# Altium project F800 Rear wire.PrjPcb
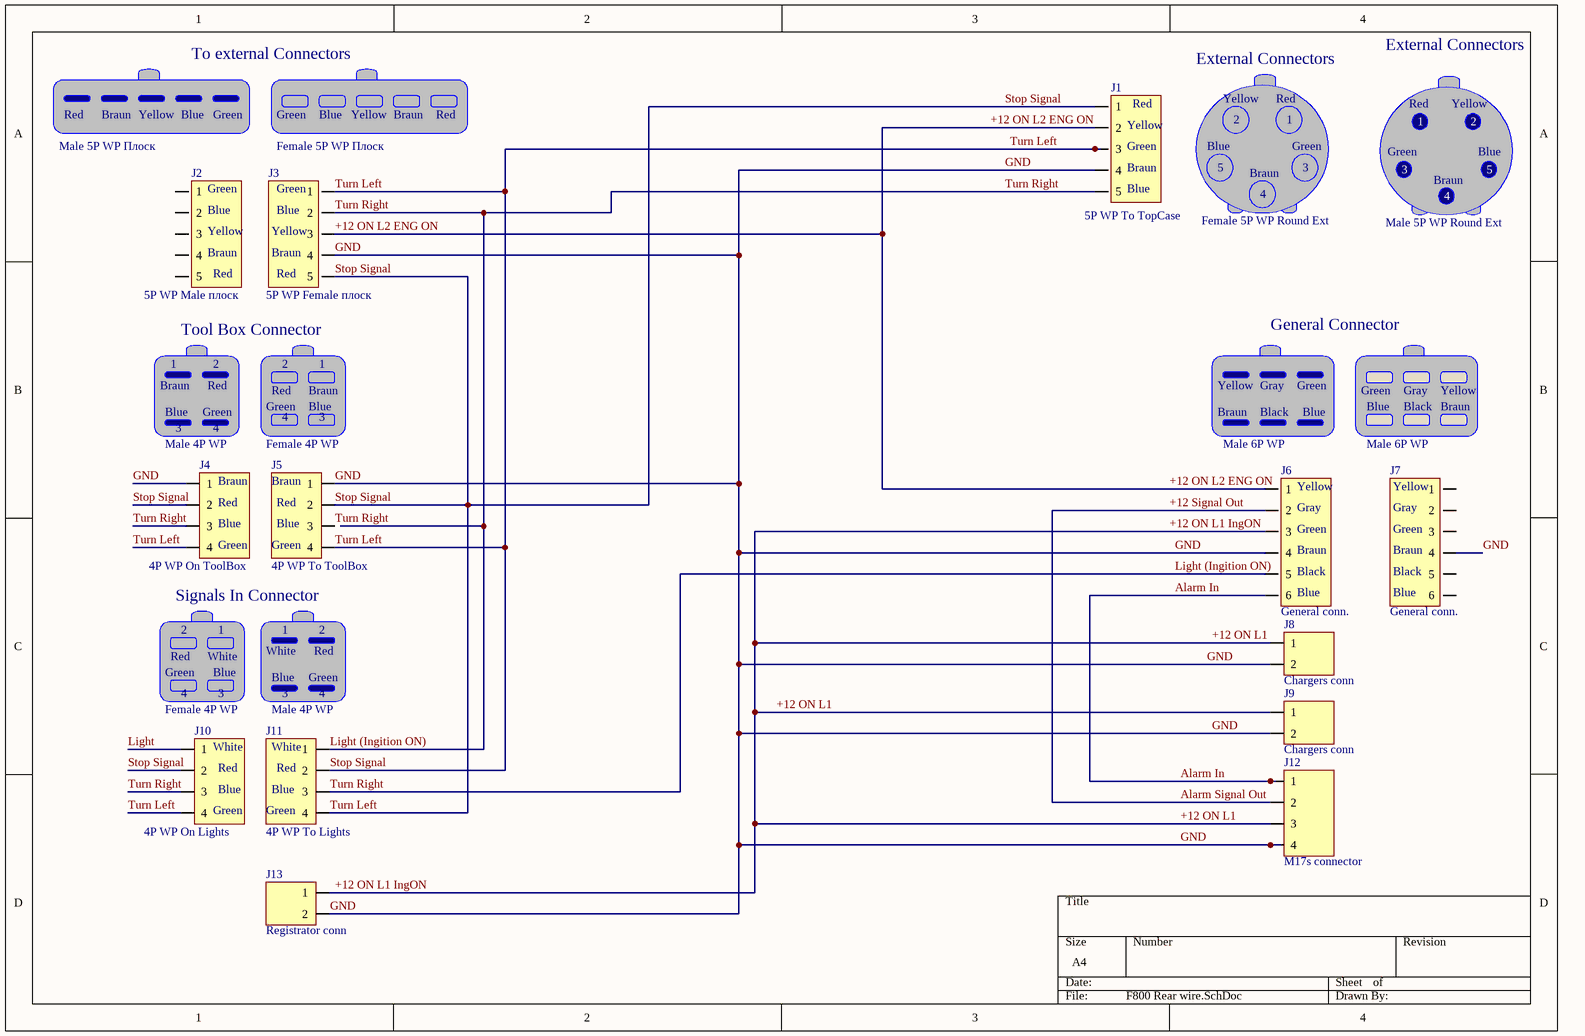
[diagram p0: F800 Rear wire.SchDoc]
2 sheets, 13 parts. Net scope: global (net labels, ports and power ports of the same name join across sheets).
Sheets:
  F800 Rear wire.SchDoc
  F800 Rear wire - Wire map.SchDoc

## Sheet F800 Rear wire.SchDoc
size A4

### Parts
J1  5P WP To TopCase  [Line 2.54 x 5]
J2  5P WP Male плоск  [Line 2.54 x 5]
J3  5P WP Female плоск  [Line 2.54 x 5]
J4  4P WP On ToolBox  [Line 2.54 X 4]
J5  4P WP To ToolBox  [Line 2.54 X 4]
J6  General conn.  [Line 2.54 x 6]
J7  General conn.  [Line 2.54 x 6]
J8  Chargers conn  [Line 2.54 x 2]
J9  Chargers conn  [Line 2.54 x 2]
J10  4P WP On Lights  [Line 2.54 X 4]
J11  4P WP To Lights  [Line 2.54 X 4]
J12  M17s connector  [Line 2.54 X 4]
J13  Registrator conn  [Line 2.54 x 2]

### Nets
+12 ON L1: J6.3 J8.1 J9.1 J12.3 J13.1  [also labelled +12 ON L1 IngON]
+12 ON L2 ENG ON: J1.2 J3.3 J6.1
+12 Signal Out: J6.2 J12.2  [also labelled Alarm Signal Out]
Alarm In: J6.6 J12.1
GND: J1.4 J3.4 J4.1 J5.1 J6.4 J7.4 J8.2 J9.2 J12.4 J13.2
Light: J10.1
Light (Ingition ON): J1.5 J3.2 J4.3 J5.3 J6.5 J10.3 J11.1 J11.3  [also labelled Turn Right]
Stop Signal: J1.1 J1.3 J3.1 J3.5 J4.2 J4.4 J5.2 J5.4 J10.2 J10.4 J11.2 J11.4  [also labelled Turn Left]

Not connected (* = marked no-connect by the designer): J2 1 2 3 4 5; J7 1 2 3 5 6

### Notes on the sheet
- To external Connectors
- (near J1) Red
- External Connectors
- Yellow
- Red
- (near J2) Male 5P WP Плоск
- Braun
- Blue
- Green
- (near J3) Female 5P WP Плоск
- (near J1) Yellow
- (near J1) Green
- (near J1) Braun
- 5
- 2
- 1
- 3
- (near J2) Yellow
- (near J2) Blue
- (near J2) Green
- (near J3) Yellow
- (near J3) Blue
- (near J3) Green
- (near J1) Blue
- Female 5P WP Round Ext
- 4
- Male 5P WP Round Ext
- (near J2) Braun
- (near J2) Red
- (near J3) Braun
- (near J3) Red
- Tool Box Connector
- General Connector
- (near J4) Male 4P WP
- (near J4) 3
- (near J4) 4
- (near J5) Female 4P WP
- (near J6) Male 6P WP
- Black
- Gray
- (near J7) Male 6P WP
- (near J4) Red
- (near J4) Braun
- (near J5) Braun
- (near J5) Red
- (near J6) Yellow
- (near J6) Gray
- (near J7) Yellow
- (near J7) Gray
- (near J4) Blue
- (near J4) Green
- (near J5) Green
- (near J5) Blue
- (near J6) Green
- (near J6) Braun
- (near J6) Black
- (near J7) Green
- (near J7) Braun
- (near J7) Black
- Signals In Connector
- White
- (near J6) Blue
- (near J7) Blue
- (near J10) Female 4P WP
- (near J10) 4
- (near J10) 3
- (near J11) Male 4P WP
- (near J11) 4
- (near J10) White
- (near J10) Red
- (near J11) White
- (near J11) Red
- (near J10) Green
- (near J10) Blue
- (near J11) Green
- (near J11) Blue

### Library data of the parts
J1-J3 = PLS-5: Vert, Sgl line, Male
J4 J5 J10-J12 = PLS-4: Vert, Sgl line, Male
J6 J7 = PLS-6: Vert, Sgl line, Male
J8 J9 J13 = PLS-2: Vert, Sgl line, Male

## Sheet F800 Rear wire - Wire map.SchDoc
size A4; Organization: Altium Limited; Address1: L3, 12a Rodborough Rd; Address2: Frenchs Forest; Address3: NSW; Address4: Australia 2086
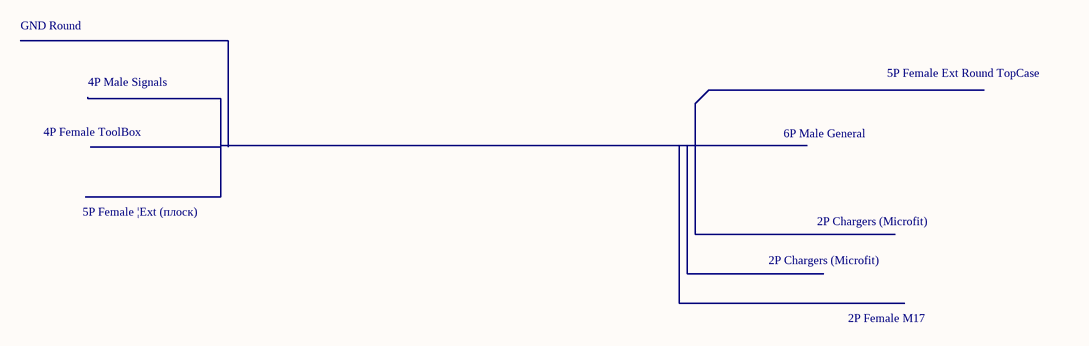
[diagram p1: F800 Rear wire - Wire map.SchDoc]

### Notes on the sheet
- GND Round
- 4P Male Signals
- 5P Female Ext Round TopCase
- 4P Female ToolBox
- 6P Male General
- 5P Female |Ext (плоск)
- 2P Chargers (Microfit)
- 2P Female M17
- Title
- Size:
- Date:
- A4
- Number:
- Time:
- Revision:
- Sheet
- of
- File: